# Altium schematic sheet MT48LC4M16A2.SchDoc
size A4
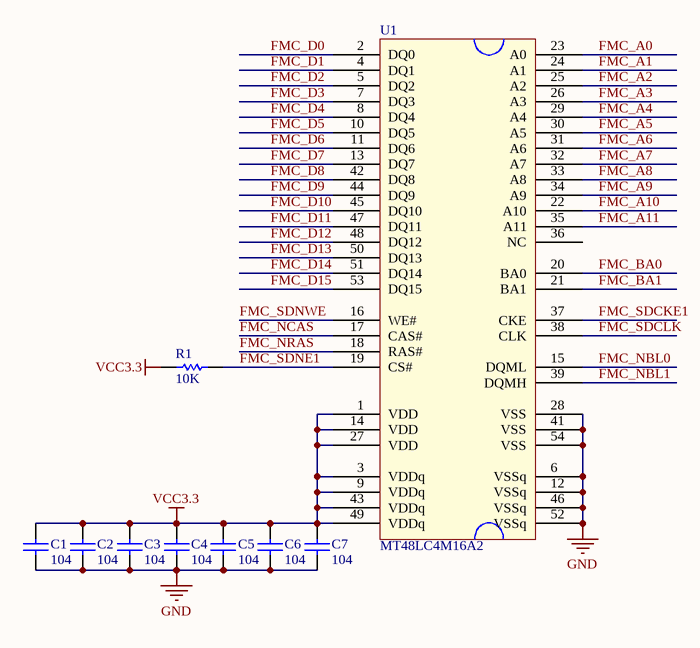
[diagram p0: MT48LC4M16A2.SchDoc]

## Parts
C1  104  [0603C]
C2  104  [0603C]
C3  104  [0603C]
C4  104  [0603C]
C5  104  [0603C]
C6  104  [0603C]
C7  104  [0603C]
R1  10K  [0603R]
U1  MT48LC4M16A2  [TSOP-54]

## Nets
GND: C1.1 C2.1 C3.1 C4.1 C5.1 C6.1 C7.1 U1.6(VSSq) U1.12(VSSq) U1.28(VSS) U1.41(VSS) U1.46(VSSq) U1.52(VSSq) U1.54(VSS)
VCC3.3: C1.2 C2.2 C3.2 C4.2 C5.2 C6.2 C7.2 R1.1 U1.1(VDD) U1.3(VDDq) U1.9(VDDq) U1.14(VDD) U1.27(VDD) U1.43(VDDq) U1.49(VDDq)
FMC_A0: U1.23(A0)
FMC_A1: U1.24(A1)
FMC_A2: U1.25(A2)
FMC_A3: U1.26(A3)
FMC_A4: U1.29(A4)
FMC_A5: U1.30(A5)
FMC_A6: U1.31(A6)
FMC_A7: U1.32(A7)
FMC_A8: U1.33(A8)
FMC_A9: U1.34(A9)
FMC_A10: U1.22(A10)
FMC_A11: U1.35(A11)
FMC_BA0: U1.20(BA0)
FMC_BA1: U1.21(BA1)
FMC_D0: U1.2(DQ0)
FMC_D1: U1.4(DQ1)
FMC_D2: U1.5(DQ2)
FMC_D3: U1.7(DQ3)
FMC_D4: U1.8(DQ4)
FMC_D5: U1.10(DQ5)
FMC_D6: U1.11(DQ6)
FMC_D7: U1.13(DQ7)
FMC_D8: U1.42(DQ8)
FMC_D9: U1.44(DQ9)
FMC_D10: U1.45(DQ10)
FMC_D11: U1.47(DQ11)
FMC_D12: U1.48(DQ12)
FMC_D13: U1.50(DQ13)
FMC_D14: U1.51(DQ14)
FMC_D15: U1.53(DQ15)
FMC_NBL0: U1.15(DQML)
FMC_NBL1: U1.39(DQMH)
FMC_NCAS: U1.17(CAS#)
FMC_NRAS: U1.18(RAS#)
FMC_SDCKE1: U1.37(CKE)
FMC_SDCLK: U1.38(CLK)
FMC_SDNE1: R1.2 U1.19(CS#)
FMC_SDNWE: U1.16(WE#)

Not connected (* = marked no-connect by the designer): U1 36(NC) 40(NC)

## Library data of the parts
C1-C7 = CAP-0603: 电容
R1 = RES-0603: Resistance
U1 = MT48LC4M16A2: 16位64Mb SDRAM